# EAGLE design badge (EAGLE 5.11)

## Sheet 1 of 3
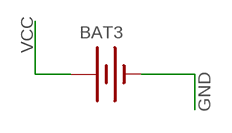
[diagram p0: schematic, sheet 1]

### Parts
BAT3  BATTERYCR123A  [BATTERY_CR123A]

### Nets
GND: BAT3.- ; also sheet 2,3
VCC: BAT3.+ ; also sheet 2,3

## Sheet 2 of 3
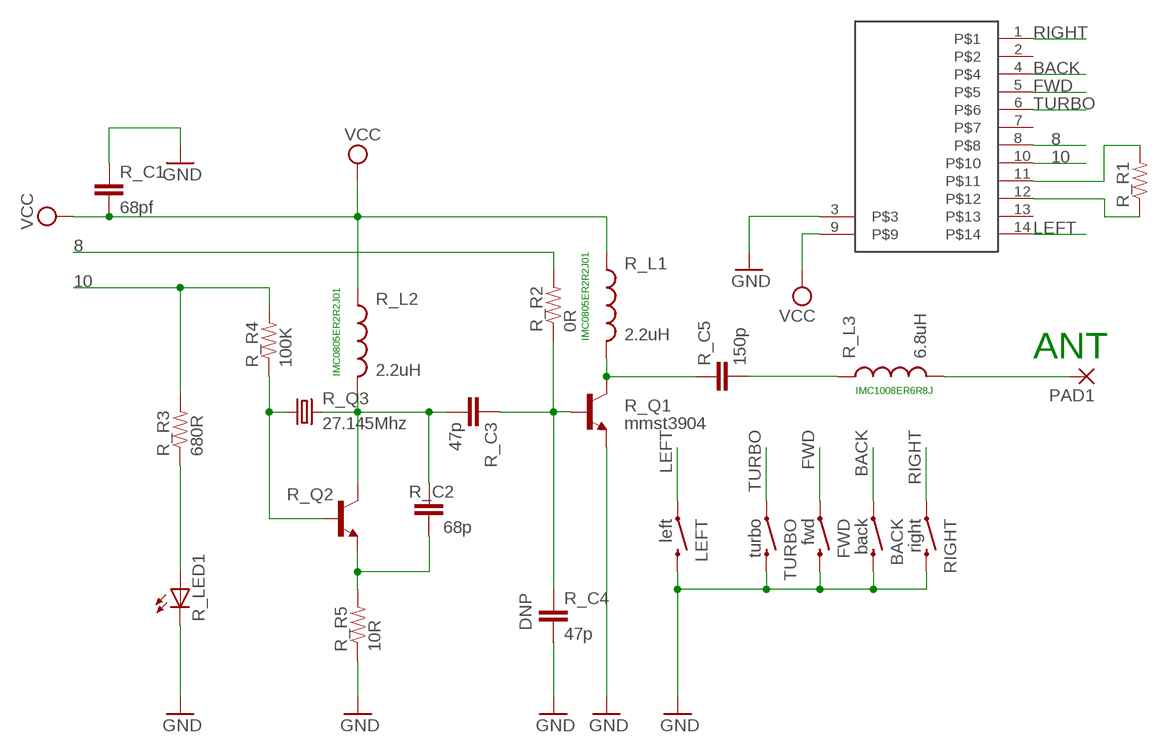
[diagram p1: schematic, sheet 2]

### Parts
BACK  back  SWITCH-MOMENTARY-2-SMD-1101NE  [TACTILE-SWITCH-1101NE]
FWD  fwd  SWITCH-MOMENTARY-2-SMD-1101NE  [TACTILE-SWITCH-1101NE]
LEFT  left  SWITCH-MOMENTARY-2-SMD-1101NE  [TACTILE-SWITCH-1101NE]
PAD1  2,54/1,0  [2,54/1,0]
R_C1  68pf  CAP0805  [0805]
R_C2  68p  CAP0805  [0805]
R_C3  47p  CAP0805  [0805]
R_C4  47p  CAP0805  [0805]
R_C5  150p  CAP0805  [0805]
R_L1  2.2uH  INDUCTOR0805  [0805]
R_L2  2.2uH  INDUCTOR0805  [0805]
R_L3  6.8uH  INDUCTOR0805  [0805]
R_LED1  LEDCHIPLED_1206  [CHIPLED_1206]
R_Q1  mmst3904  TRANSISTOR_NPNSOT23-3  [SOT23-3]
R_Q2  TRANSISTOR_NPNSOT23-3  [SOT23-3]
R_Q3  27.145Mhz  CRYSTALHC49US  [HC49US]
R_R1  RESISTORPTH-1/4W  [AXIAL-0.4]
R_R2  0R  RESISTOR  [0805]
R_R3  680R  RESISTOR  [0805]
R_R4  100K  RESISTOR  [0805]
R_R5  10R  RESISTOR  [0805]
R_U1  TX-2B  [DIP14]
RIGHT  right  SWITCH-MOMENTARY-2-SMD-1101NE  [TACTILE-SWITCH-1101NE]
TURBO  turbo  SWITCH-MOMENTARY-2-SMD-1101NE  [TACTILE-SWITCH-1101NE]

### Nets
8: R_R2.2 R_U1.8
10: R_R3.2 R_R4.2 R_U1.10
BACK: BACK.P$1 R_U1.4 ; also sheet 3
FWD: FWD.P$1 R_U1.5 ; also sheet 3
GND: BACK.P$2 FWD.P$2 LEFT.P$2 R_C1.1 R_C4.2 R_LED1.C R_Q1.2(E) R_R5.1 R_U1.3 RIGHT.P$2 TURBO.P$2 ; also sheet 1,3
LEFT: LEFT.P$1 R_U1.14 ; also sheet 3
N$4: R_C5.1 R_L1.2 R_Q1.3(C)
N$10: R_R1.P$2 R_U1.11
N$11: R_R1.P$1 R_U1.12
N$12: R_C3.1 R_C4.1 R_Q1.1(B) R_R2.1
N$13: R_C2.2 R_C3.2 R_L2.2 R_Q2.3(C) R_Q3.2
N$14: R_Q2.1(B) R_Q3.1 R_R4.1
N$15: R_C2.1 R_Q2.2(E) R_R5.2
N$16: R_LED1.A R_R3.1
N$17: R_C5.2 R_L3.1
N$18: PAD1.1(P) R_L3.2
RIGHT: R_U1.1 RIGHT.P$1 ; also sheet 3
TURBO: R_U1.6 TURBO.P$1 ; also sheet 3
VCC: R_C1.2 R_L1.1 R_L2.1 R_U1.9 ; also sheet 1,3
Unconnected: R_U1.2 R_U1.7 R_U1.13

### Notes on the sheet
- IMC0805ER2R2J01
- ANT
- IMC0805ER2R2J01
- IMC1008ER6R8J
- DNP

## Sheet 3 of 3
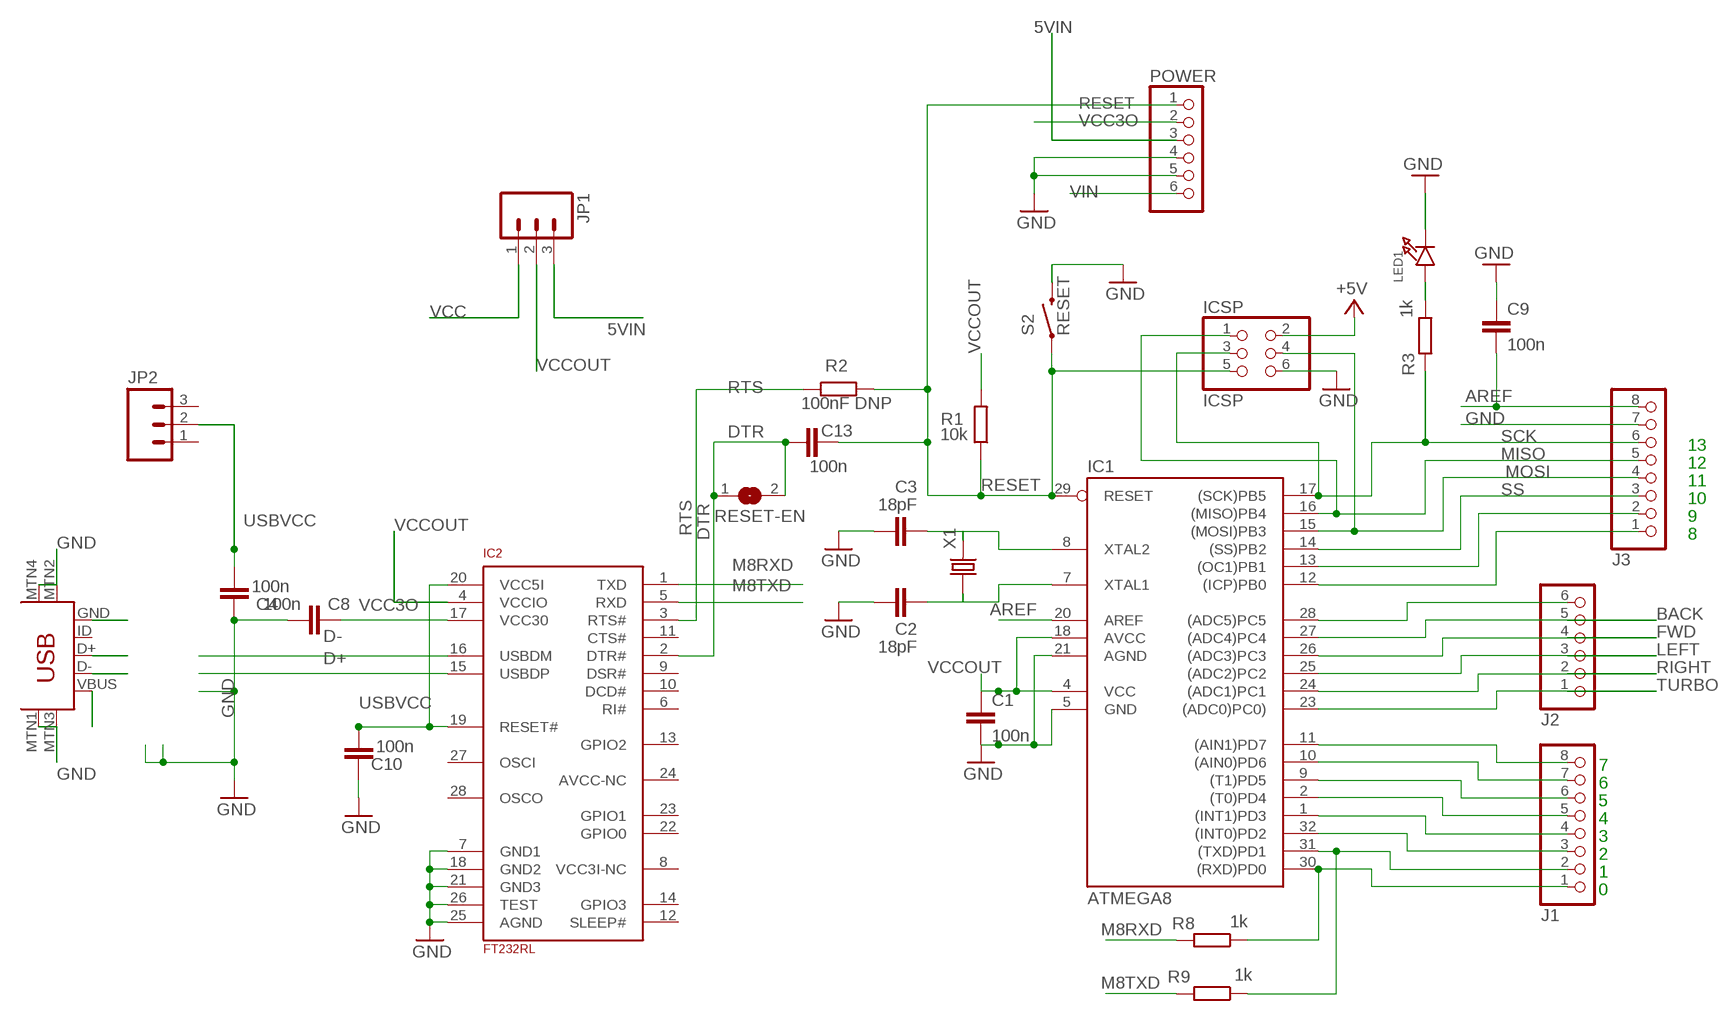
[diagram p2: schematic, sheet 3]

### Parts
C1  100n  C-EU  [C0805RND]
C2  18pF  C-EU  [C0805RND]
C3  18pF  C-EU  [C0805RND]
C4  100n  C-EU  [C0805RND]
C8  100n  C-EU  [C0805RND]
C9  100n  C-EU  [C0805RND]
C10  100n  C-EU  [C0805RND]
C13  100n  C-EU  [C0805RND]
IC1  ATMEGA8  AT90S4433A  [TQFP32-08]
IC2  FT232RL  [SSOP28]
ICSP  ICSP  PINHD-2X3  [2X03]
J1  PINHD-1X8  [1X08]
J2  PINHD-1X6  [1X06]
J3  PINHD-1X8  [1X08]
JP1  M03LOCK  [1X03_LOCK]
JP2  M03LOCK  [1X03_LOCK]
LED1  LED1206  [CHIPLED_1206]
POWER  PINHD-1X6  [1X06]
R1  10k  R-EU_  [R0805RND]
R2  100nF DNP  R-EU_  [R0805RND]
R3  1k  R-EU_  [R0805RND]
R8  1k  R-EU_  [R0805RND]
R9  1k  R-EU_  [R0805RND]
RESET-EN  SJ  [SJ]
S2  RESET  SWITCH-MOMENTARY-2-SMD-1101NE  [TACTILE-SWITCH-1101NE]
U$1  USB-MINIB-5PIN  [USB-MINIB]
X1  CRYSTAL-5032  [5032]

### Nets
5VIN: JP1.3 POWER.3
AREF [aref]: C9.2 IC1.20(AREF) J3.8
BACK: IC1.27((ADC4)PC4) J2.5 ; also sheet 2
D+: IC2.15(USBDP) U$1.D+
D-: IC2.16(USBDM) U$1.D-
DTR: C13.1 IC2.2(DTR#) RESET-EN.1 RESET-EN.2
FWD: IC1.26((ADC3)PC3) J2.4 ; also sheet 2
GND: C1.2 C2.1 C3.1 C4.2 C8.1 C9.1 C10.2 IC1.5(GND) IC1.21(AGND) IC2.7(GND1) IC2.18(GND2) IC2.21(GND3) IC2.25(AGND) IC2.26(TEST) ICSP.6 J3.7 LED1.C POWER.4 POWER.5 S2.P$2 U$1.GND U$1.MTN1(MTN2) U$1.MTN2(MTN3) U$1.MTN3(MTN1) U$1.MTN4 ; also sheet 1,2
LEFT: IC1.25((ADC2)PC2) J2.3 ; also sheet 2
M8RXD: IC2.1(TXD) R8.2
M8TXD: IC2.5(RXD) R9.2
MISO: IC1.16((MISO)PB4) ICSP.1 J3.5
MOSI: IC1.15((MOSI)PB3) ICSP.4 J3.4
N$1: IC1.32((INT0)PD2) J1.3
N$2: IC1.1((INT1)PD3) J1.4
N$3: IC1.2((T0)PD4) J1.5
N$5: IC1.9((T1)PD5) J1.6
N$6: C2.2 IC1.7(XTAL1) X1.1
N$7: C3.2 IC1.8(XTAL2) X1.2
N$8: IC1.10((AIN0)PD6) J1.7
N$9: IC1.11((AIN1)PD7) J1.8
N$19: LED1.A R3.1
N$24: IC1.28((ADC5)PC5) J2.6
N$25: IC1.12((ICP)PB0) J3.1
N$26: IC1.13((OC1)PB1) J3.2
PD0: IC1.30((RXD)PD0) J1.1 R8.1
PD1: IC1.31((TXD)PD1) J1.2 R9.1
RESET: C13.2 IC1.29(RESET) ICSP.5 POWER.1 R1.1 R2.2 S2.P$1
RIGHT: IC1.24((ADC1)PC1) J2.2 ; also sheet 2
RTS: IC2.3(RTS#) R2.1
SCK: IC1.17((SCK)PB5) ICSP.3 J3.6 R3.2
SS: IC1.14((SS)PB2) J3.3
TURBO: IC1.23((ADC0)PC0)) J2.1 ; also sheet 2
USBVCC [usbvcc]: C4.1 C10.1 IC2.19(RESET#) IC2.20(VCC5I) JP2.2 U$1.VBUS
VCC: JP1.1 ; also sheet 1,2
VCC3O: C8.2 IC2.17(VCC30) POWER.2
VCCOUT [usbvcc]: C1.1 IC1.4(VCC) IC1.18(AVCC) IC2.4(VCCIO) ICSP.2 JP1.2 R1.2 ; supply symbol labelled +5V
VIN [power]: POWER.6
Unconnected: IC2.6(RI#) IC2.8(VCC3I-NC) IC2.9(DSR#) IC2.10(DCD#) IC2.11(CTS#) IC2.12(SLEEP#) IC2.13(GPIO2) IC2.14(GPIO3) IC2.22(GPIO0) IC2.23(GPIO1) IC2.24(AVCC-NC) IC2.27(OSCI) IC2.28(OSCO) JP2.1 JP2.3 U$1.ID

### Notes on the sheet
- 13
- 12
- 11
- 10
- 9
- 8
- 7
- 6
- 5
- 4
- 3
- 2
- 1
- 0

## Library data of the parts
BACK FWD LEFT RIGHT TURBO = rf_blinky:SWITCH-MOMENTARY-2
BAT3 = tvbgone-adj:BATTERY: Battery Holders Various common sizes : AA, AAA, 20mm coin cell and 12mm coin cell.
C1-C4 C8-C10 C13 = rcl:C-EU: CAPACITOR, European symbol
IC1 = atmel:AT90S4433: MICROCONTROLLER 4 Kbytes FLASH 128 bytes SRAM 256 bytes EEPROM UART 6-channel 10 bit ADC
IC2 = SmartPrj:FT232RL
ICSP = pinhead:PINHD-2X3: PIN HEADER
J1 J3 = pinhead:PINHD-1X8: PIN HEADER
J2 POWER = pinhead:PINHD-1X6: PIN HEADER
JP1 JP2 = SparkFun:M03: Header 3 Standard 3-pin 0.1" header. Use with straight break away headers (SKU : PRT-00116), right angle break away headers (PRT-00553), swiss pins (PRT-00743), machine pins (PRT-00117), and female headers (PRT-00115). Molex polarized connector foot print use with SKU : PRT-08232 with associated crimp pins and housings.
LED1 = microbuilder:LED: LED
PAD1 = wirepad:2,54/1,0: THROUGH-HOLE PAD
R1-R3 R8 R9 = rcl:R-EU_: RESISTOR, European symbol
R_C1-R_C5 = SparkFun:CAP: Capacitor Standard 0603 ceramic capacitor, and 0.1" leaded capacitor.
R_L1-R_L3 = rf_blinky:INDUCTOR: Inductors Basic Inductor/Choke - 0603 and 1206. Footprints are not proven and vary greatly between part numbers.
R_LED1 = led:LED: LED
R_Q1 R_Q2 = SparkFun:TRANSISTOR_NPN: Transistor NPN BJT configuration in SOT23 package. MMBT2222 is the common NPN we use. Double check BCE configuration again layout.
R_Q3 = SparkFun:CRYSTAL: Crystals Various standard crystals. Proven footprints. Spark Fun Electronics SKU : COM-00534
R_R1 = rf_blinky:RESISTOR: Resistor
R_R2-R_R5 = V3_slice_noshift:RESISTOR: Resistor
R_U1 = badge:TX-2B
RESET-EN = jumper:SJ: SMD solder JUMPER
S2 = SparkFun:SWITCH-MOMENTARY-2
U$1 = SparkFun:USB-MINIB: Mini-USB "B" connector with 5th pin broken out. Created new symbol breaking out 5th "ID" pin in mini/micro USB connector spec. See: http://en.wikipedia.org/wiki/Mini_usb#Cables. Uses same footprint as 4-pin symbol. Also added pins to connect to mounting / shield pads if required (probably not generally needed as signals aren't shielded once they leave the connector).
X1 = slice:CRYSTAL*: CRYSTAL

## Net classes
0 default: width 0.254 mm, drill 0.305 mm, clearance 0.152 mm
1 power: width 0.61 mm, drill 0.508 mm, clearance 0.152 mm
2 gnd: width 0.305 mm, drill 0.508 mm, clearance 0.152 mm
3 usbvcc: width 0.508 mm, drill 0.508 mm, clearance 0.152 mm
4 aref: width 0.406 mm

## Board
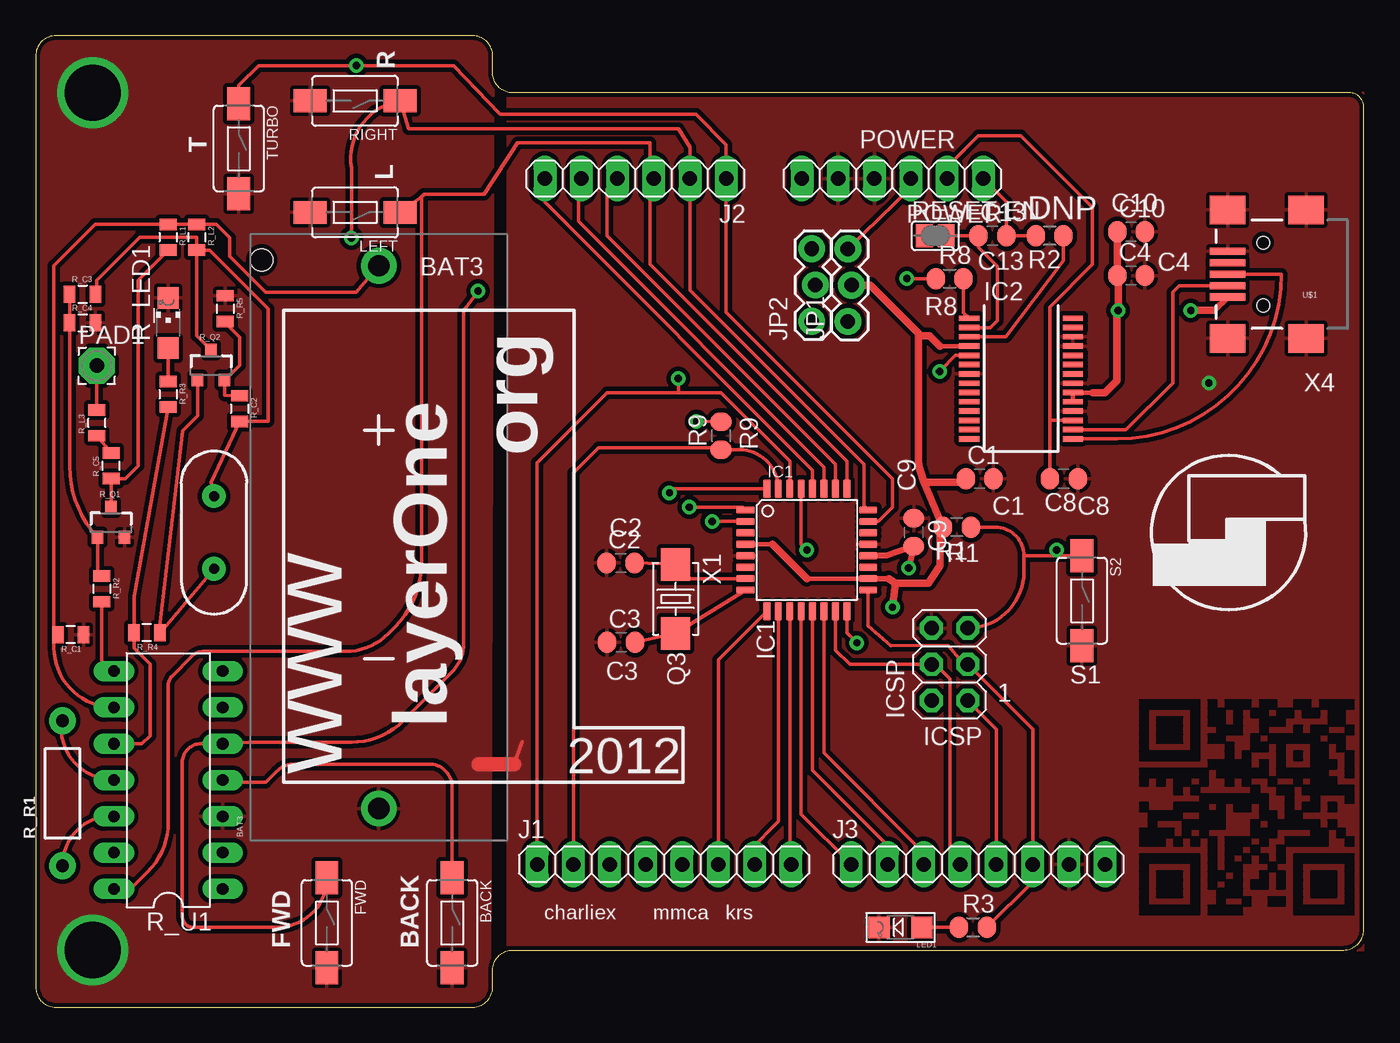
[diagram p3: board, top side]
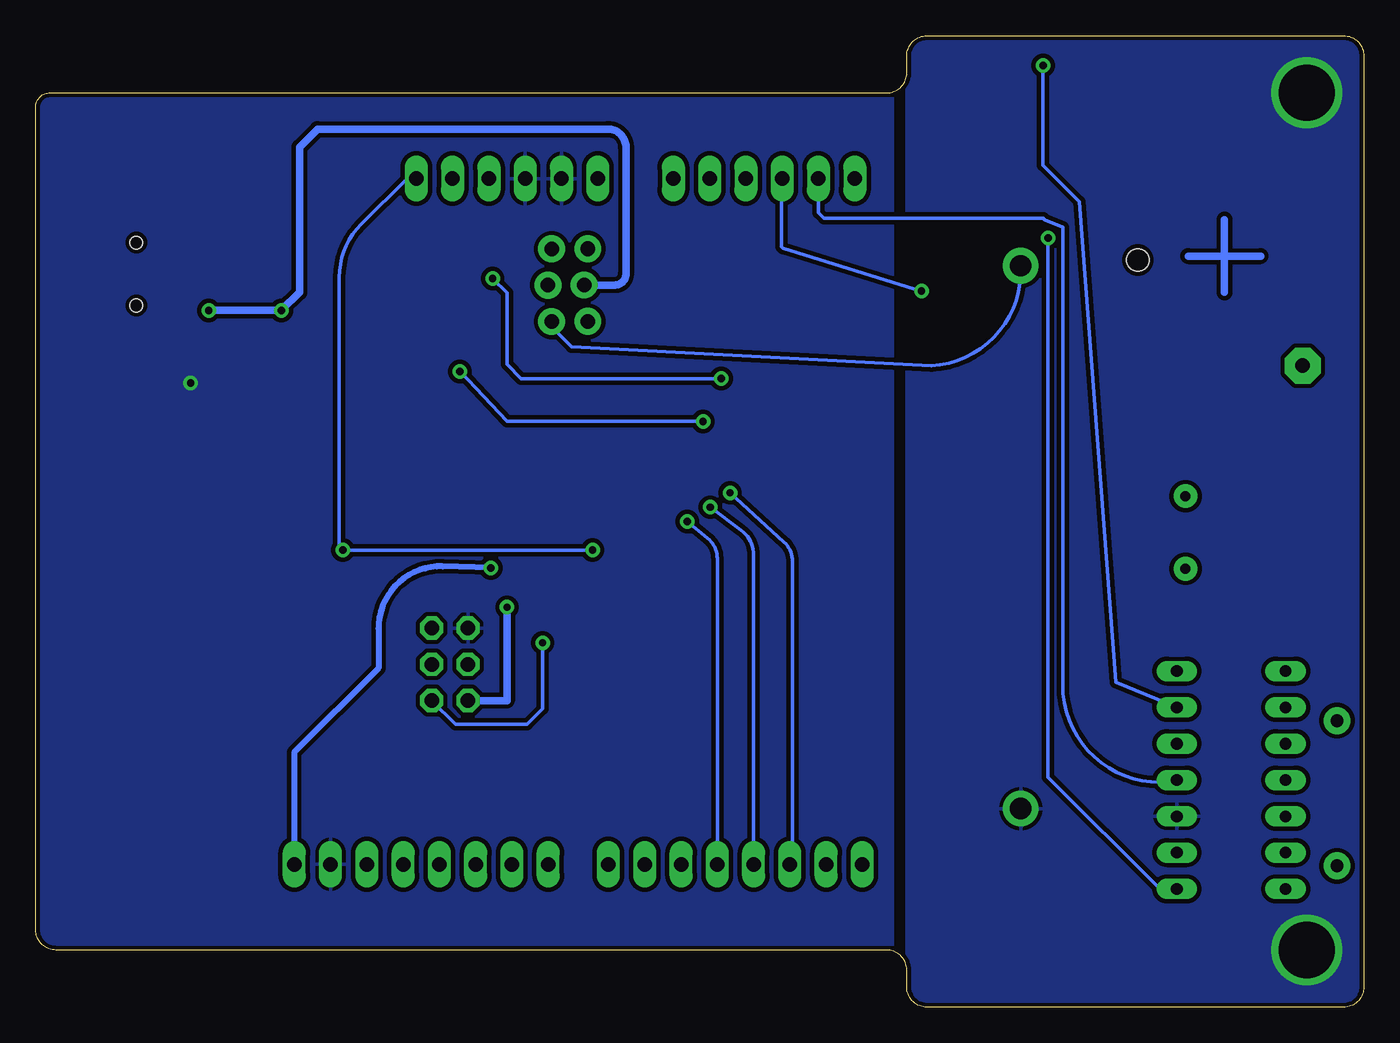
[diagram p4: board, bottom side, seen from below]

Size 93 x 68 mm. Coordinates in mm from the lower left corner, seen from the top.
Outline: 33.41,64 arc-90 32,65.41 32,66.59 arc90 30.59,68 1.41,68 arc90 0,66.59 0,1.41 arc90 1.41,0 30.59,0 arc90 32,1.41 32,2.59 arc-90 33.41,4 91.59,4 arc90 93,5.41 93,63 arc90 92,64 33.41,64
Copper layers (1*16): Top 0.0356mm / dielectric 1.5011mm / Bottom 0.0356mm
Design rules "SparkFun-mod *": minimum track width 8mil, minimum drill 20mil, track to track 12mil, track to pad 12mil, pad to pad 8mil, via to via 8mil, smd to smd 8mil, copper to edge 12mil, drill to drill 8mil, minimum pad ring 12mil, minimum via ring 10mil, stop-mask expansion 4mil, vias tented up to drill 25mil, thermal gap 10mil
tRestrict: area 77.3,6.5 to 77.9,7.1; area 77.3,7.1 to 77.9,7.7; area 77.3,7.7 to 77.9,8.3; area 77.3,8.3 to 77.9,8.9; area 77.3,8.9 to 77.9,9.5; area 77.3,9.5 to 77.9,10.1; area 77.3,10.1 to 77.9,10.7; area 77.3,11.3 to 77.9,11.9; area 77.3,11.9 to 77.9,12.5; area 77.3,13.7 to 77.9,14.3; area 77.3,15.5 to 77.9,16.1; area 77.3,16.1 to 77.9,16.7; 319 more areas
Milling: 16 lines

### Footprints (pad centres in the part's own frame; a part is rotated, then mirrored left to right if it is on the bottom)
TACTILE-SWITCH-1101NE = smd 2.3 x 1.6: P$1 -3.15,0; P$2 3.15,0
BATTERY_CR123A = drill 1.5 pad 2.5 round: + 19,0; - -19,0 | hole 1.575: 19.4,8.2
C0805RND = smd 1.3 x 1.5: 1 -0.977,0; 2 0.977,0
TQFP32-08 = smd 1.27 x 0.508: 1 -4.293,2.8; 2 -4.293,2; 3 -4.293,1.2; 4 -4.293,0.4; 5 -4.293,-0.4; 6 -4.293,-1.2; 7 -4.293,-2; 8 -4.293,-2.8; 17 4.293,-2.8; 18 4.293,-2; 19 4.293,-1.2; 20 4.293,-0.4; 21 4.293,0.4; 22 4.293,1.2; 23 4.293,2; 24 4.293,2.8 | smd 0.508 x 1.27: 9 -2.8,-4.293; 10 -2,-4.293; 11 -1.2,-4.293; 12 -0.4,-4.293; 13 0.4,-4.293; 14 1.2,-4.293; 15 2,-4.293; 16 2.8,-4.293; 25 2.8,4.293; 26 2,4.293; 27 1.2,4.293; 28 0.4,4.293; 29 -0.4,4.293; 30 -1.2,4.293; 31 -2,4.293; 32 -2.8,4.293
SSOP28 = smd 0.381 x 1.499: 1 -4.225,-3.625; 2 -3.575,-3.625; 3 -2.925,-3.625; 4 -2.275,-3.625; 5 -1.625,-3.625; 6 -0.975,-3.625; 7 -0.325,-3.625; 8 0.325,-3.625; 9 0.975,-3.625; 10 1.625,-3.625; 11 2.275,-3.625; 12 2.925,-3.625; 13 3.575,-3.625; 14 4.225,-3.625; 15 4.225,3.625; 16 3.575,3.625; 17 2.925,3.625; 18 2.275,3.625; 19 1.625,3.625; 20 0.975,3.625; 21 0.325,3.625; 22 -0.325,3.625; 23 -0.975,3.625; 24 -1.625,3.625; 25 -2.275,3.625; 26 -2.925,3.625; 27 -3.575,3.625; 28 -4.225,3.625
2X03 = drill 1.016 octagon: 1 -2.54,-1.27; 2 -2.54,1.27; 3 0,-1.27; 4 0,1.27; 5 2.54,-1.27; 6 2.54,1.27
1X08 = drill 1.016 long: 1 -8.89,0; 2 -6.35,0; 3 -3.81,0; 4 -1.27,0; 5 1.27,0; 6 3.81,0; 7 6.35,0; 8 8.89,0
1X06 = drill 1.016 long: 1 -6.35,0; 2 -3.81,0; 3 -1.27,0; 4 1.27,0; 5 3.81,0; 6 6.35,0
1X03_LOCK = drill 1.016 pad 1.88 round: 1 0,0.127; 2 2.54,-0.127; 3 5.08,0.127
CHIPLED_1206 = smd 1.5 x 1.5: A 0,-1.496; C 0,1.496
2,54/1,0 = drill 1.016 pad 2.54 octagon: 1 0,0
R0805RND = smd 1.3 x 1.5: 1 -0.977,0; 2 0.977,0
0805 = smd 0.8 x 1.2: 1 -0.9,0; 2 0.9,0
CHIPLED_1206' = smd 1.5 x 1.5: A 0,-1.75; C 0,1.75
SOT23-3 = smd 0.8 x 0.9: 1 -0.95,-1; 2 0.95,-1; 3 0,1.1
HC49US = drill 0.7 pad 1.651 round: 1 -2.54,0; 2 2.54,0
AXIAL-0.4 = drill 0.9 pad 1.88 round: P$1 -5.08,0; P$2 5.08,0
DIP14 = drill 0.813 long: 1 -7.62,-3.81; 2 -5.08,-3.81; 3 -2.54,-3.81; 4 0,-3.81; 5 2.54,-3.81; 6 5.08,-3.81; 7 7.62,-3.81; 8 7.62,3.81; 9 5.08,3.81; 10 2.54,3.81; 11 0,3.81; 12 -2.54,3.81; 13 -5.08,3.81; 14 -7.62,3.81
SJ = smd 1.168 x 1.6: 1 -0.762,0; 2 0.762,0
USB-MINIB = smd 2.5 x 0.5: D+ 2.5,0; D- 2.5,0.8; GND 2.5,-1.6; ID 2.5,-0.8; VBUS 2.5,1.6 | smd 2.5 x 2: MTN1 -3,4.5; MTN2 2.5,4.5; MTN3 -3,-4.5; MTN4 2.5,-4.5 | hole 0.9: 0,2.2; 0,-2.2
5032 = smd 2.286 x 2.032: 1 -2.413,0; 2 2.413,0

### Placement (x,y rotation side)
BACK  29.17,5.9 270 top
BAT3  24.03,32.9 90 top
C1  66.1,37 0 top
C2  40.96,31.09 0 top
C3  40.99,25.54 0 top
C4  76.71,51.21 0 top
C8  72,37 180 top
C9  61.48,33.25 270 top
C10  76.71,54.27 0 top
C13  67,54 0 top
FWD  20.39,5.9 270 top
IC1  54,32 0 top
IC2  69,44 270 top
ICSP  64,24 90 top
J1  44,10 0 top
J2  42,58 180 top
J3  66,10 0 top
JP1  57,48 90 top
JP2  54.46,48.01 90 top
LED1  60.56,5.59 90 top
LEFT  22.36,55.63 180 top
PAD1  4.28,44.9 0 top
POWER  60,58 180 top
R1  64.5,33.6 180 top
R2  71,54 180 top
R3  65.64,5.59 0 top
R8  64,51 0 top
R9  48,40 90 top
R_C1  [0805]  2.45,26.08 180 top
R_C2  47p  [0805]  14.28,41.9 270 top
R_C3  3.28,49.9 0 top
R_C4  3.28,47.9 0 top
R_C5  5.28,37.9 90 top
R_L1  9.28,53.9 270 top
R_L2  11.28,53.9 270 top
R_L3  4.28,40.9 90 top
R_LED1  [CHIPLED_1206']  9.28,47.9 0 top
R_Q1  [SOT23-3]  5.28,33.9 0 top
R_Q2  12.28,44.9 0 top
R_Q3  12.48,33.23 90 top
R_R1  1.87,14.97 90 top
R_R2  10K  [0805]  4.63,29.28 270 top
R_R3  9.28,42.9 270 top
R_R4  7.79,26.21 180 top
R_R5  13.28,48.9 270 top
R_U1  9.28,15.9 90 top
RESET-EN  63,54 0 top
RIGHT  22.36,63.44 180 top
S2  73.26,28.45 270 top
TURBO  14.22,60.1 270 top
U$1  85.96,51.31 180 top
X1  44.81,28.58 270 top

### Tracks (layer width: path | path; a pad name or v marks a point on that pad's centre or on a via)
5VIN
  Top 0.254: JP1.3 61.27,57.35 POWER.3
8
  Top 0.254: R_U1.8 arc-90 4.63,24.36 R_R2.2
10
  Top 0.254: R_U1.10 7.44,18.44 8,19 8,24 6.89,25.11 R_R4.2 6.91,28.77 R_R3.2
AREF  (via drill 0.51)
  Top 0.406: IC1.20 59.58,31.6 C9.2 v61.13,30.75
  Bottom 0.406: v61.13,30.75 64.5,30.85 arc-92 69,26.5 69,23.73 74.89,17.84 J3.8
BACK
  Top 0.254: IC1.27 55.2,37.8 38,55 38,57.81 J2.5 | 14.28,15.9 R_U1.4 13.24,15.75 16.11,15.75 16.85,16.49 arc-45 18.12,17.02 27.54,17.02 arc-90 29.17,15.39 BACK.P$1
  Bottom 0.254: 38.13,57.94 J2.5 38.19,55.61 37.79,55.21 22.46,55.21 arc90 22.36,55.11 21.09,54.6 21.09,22.55 arc-90 14.28,15.74 13.25,15.74 arc-90 R_U1.4
D+
  Top 0.254: U$1.D+ 87.23,51.31 arc-90 75.69,39.77 IC2.15
D-
  Top 0.254: U$1.D- 80.08,50.51 79.61,50.04 79.61,43.69 76.34,40.42 IC2.16
DTR
  Top 0.254: RESET-EN.1 RESET-EN.2 C13.1 66.02,53.18 67.34,51.86 67.34,48.05 66.86,47.58 IC2.2
FWD  (via drill 0.51)
  Top 0.254: IC1.26 56,38 40,54 40,57.27 J2.4 | v30.97,50.13 29.98,48.76 29.98,25.5 arc-45 29.12,23.43 25.74,20.05 arc-45 22.11,18.54 14.92,18.54 13.54,18.44 R_U1.5 11.56,18.44 arc90 10.27,17.15 10.27,6.35 arc90 11.03,5.59 16.93,5.59 arc90 FWD.P$1
  Bottom 0.254: 40.73,57 J2.4 40.77,57.96 40.77,53.23 40.67,53.13 v30.97,50.13
GND  (via drill 0.51, 3.94)
  Top 0.254: 34.05,18.57 33.48,17
  Top 1: 33.48,17 31,17
  other vias: 4,64 4,4 82.15,43.69
  pour Top (isolate 0.254): 29.23,-0.84 arc90 31.77,1.7 32.04,68.53 -0.52,68.54 -0.52,1.7 arc90 2.02,-0.84
  pour Top (isolate 0.076): 33,64 33,4 93,4 93,64
  pour Bottom (isolate 0.254): 32,68 32,-1 -1,-1 -1,68
  pour Bottom (isolate 0.254): 33,64 33,4 93,4 93,64
LEFT
  Top 0.254: IC1.25 56.8,38.2 43,52 43,57.73 J2.3 43,58.27 43,60.5 33.73,60.5 31.4,56.9 27.28,56.9 | R_U1.14 6.66,8.28 7.85,9.47 arc45 9.28,12.92 9.28,22.51 arc-45 9.55,23.17 10.97,24.59 arc-45 11.72,24.9 21.7,24.9 arc45 24.67,26.13 25.15,26.61 arc45 27.01,31.09 27.01,56.63 arc-90 27.28,56.9 | 27.28,56.9 LEFT.P$1
M8RXD
  Top 0.254: IC2.1 64.98,48.62 R8.2
M8TXD  (via drill 0.51)
  Top 0.254: IC2.5 64.4,45.62 v63.3,44.5 | v46.27,41 47.56,40.98 R9.2
  Bottom 0.254: v63.3,44.5 60,41 v46.27,41
MISO  (via drill 0.51)
  Top 0.254: ICSP.1 67.27,19.46 J3.5 67.27,9.4 | IC1.16 56.8,26.2 v57.5,25.5
  Bottom 0.254: v57.5,25.5 57.5,20.9 58.6,19.8 63.61,19.8 ICSP.1
MOSI
  Top 0.254: IC1.15 56,25 57,24 ICSP.4 63,24 64,23 64,10.73 J3.4
N$1  (via drill 0.51)
  Top 0.254: IC1.32 44.67,36.29 v44.38,36
  Bottom 0.254: J1.3 arc-90 40,10.19 40,31.2 arc-48 40.59,32.54 v44.38,36
N$2  (via drill 0.51)
  Top 0.254: v45.76,35 49.51,35 IC1.1
  Bottom 0.254: v45.76,35 43.6,33.38 arc53 42.73,31.64 J1.4
N$3  (via drill 0.51)
  Top 0.254: IC1.2 v47.38,34
  Bottom 0.254: v47.38,34 45.94,32.82 arc51 45.27,31.4 J1.5
N$4
  Top 0.254: R_L1.2 7.18,50.9 7.18,37.9 6.28,37 R_C5.1 R_Q1.3
N$5
  Top 0.254: J1.6 47.81,24.32 IC1.9
N$6
  Top 0.254: IC1.7 45.77,30 45.32,30.99 X1.1 C2.2
N$7
  Top 0.254: IC1.8 X1.2 C3.2
N$8
  Top 0.254: IC1.10 52,13 50,11 50,10.35 J1.7
N$9
  Top 0.254: IC1.11 52.8,10.09 J1.8
N$10
  Top 0.254: R_U1.11 arc-90 1.77,19.6 R_R1.P$2
N$11
  Top 0.254: R_R1.P$1 arc-90 5.24,13.36 R_U1.12
N$12
  Top 0.254: R_C3.1 R_C4.1 2.38,37.85 arc43 R_Q1.1 4.33,30.48 R_R2.1
N$13
  Top 0.254: R_Q3.2 12.28,36.73 R_C2.2 16.28,41 16.28,48.9 12.18,53 R_L2.2 | R_Q2.3 11.28,47 R_L2.2 | R_L2.2 11.28,53.9 7.28,53.9 4.28,50.9 4.28,50 R_C3.2
N$14
  Top 0.254: 8.63,26.06 R_Q3.1 | 8.63,26.06 10.28,40.33 11.33,41.38 R_Q2.1 | R_R4.1 8.69,26.12 arc-90 8.63,26.06
N$15
  Top 0.254: R_C2.1 13.23,42.85 R_Q2.2 14.28,44.95 14.28,46.9 13.28,47.9 R_R5.2
N$16
  Top 0.254: R_LED1.A R_R3.1
N$17
  Top 0.254: R_C5.2 R_L3.1
N$18
  Top 0.254: PAD1.1 R_L3.2
N$19
  Top 0.254: R3.1 LED1.A
N$20
  Bottom 0.508: 12.3,52.58 7.22,52.58
N$21
  Bottom 0.508: 9.76,55.12 9.76,50.04
N$24
  Top 0.254: IC1.28 54.4,37.6 35.65,56.35 J2.6
N$25
  Top 0.254: IC1.12 53.6,13.51 J3.1
N$26
  Top 0.254: IC1.13 54.4,16.6 59.65,11.35 J3.2
PD0  (via drill 0.51)
  Top 0.254: J1.1 35.11,38.11 40,43 45,43 | 45,43 48,43 52.8,38.2 IC1.30 | R8.1 v61,51 | v45,44 45,43
  Bottom 0.254: v61,51 60,50 60,45 59,44 v45,44
PD1
  Top 0.254: IC1.31 arc90 49.27,39.02 R9.1 | R9.1 47.98,39 | J1.2 37.65,37.41 39.4,39.16 47.86,39.16 R9.1
RESET  (via drill 0.51)
  Top 0.254: POWER.1 67.98,56.37 C13.2 R2.2 | IC1.29 53.6,32.4 v54,32 | 69.2,31.6 69.2,30.47 arc-90 ICSP.5 | 69.2,31.6 S2.P$1 71.49,31.6 v71.49,32 | 69.2,31.6 arc90 67.2,33.6 R1.1
  Bottom 0.254: POWER.1 67,58 70.21,54.79 arc-45 71.74,51.1 71.74,32 v71.49,32 v54,32
RIGHT  (via drill 0.51)
  Top 0.254: IC1.24 58,35.09 58,38 45.81,50.19 J2.2 45.81,60.19 45,61.5 26.11,61.5 RIGHT.P$1 arc90 22.11,58.76 v22.11,53.84
  Bottom 0.254: v22.11,53.84 22.11,16.1 14.28,8.28 R_U1.1
RTS
  Top 0.254: IC2.3 67.92,46.92 71.98,52.25 R2.1
SCK
  Top 0.2: 63.9,25.3 59.9,25.3
  Top 0.254: 63.9,25.3 65,24 ICSP.3 69.81,19.46 J3.6 69.81,8.78 R3.2 | 59.9,25.3 58.29,26.71 IC1.17
SS
  Top 0.254: IC1.14 55.2,17.8 62,11 62,10.19 J3.3
TURBO  (via drill 0.51)
  Top 0.254: IC1.23 59,34 60,35 60,37 48.35,48.65 J2.1 48.35,60.38 46.23,62.5 32.5,62.5 29.28,65.9 22.46,65.9 v22.46,65.91 15.6,65.91 14.22,64.53 TURBO.P$1
  Bottom 0.254: R_U1.6 17.38,22.73 19.92,56.39 22.46,58.93 v22.46,65.91
USBVCC  (via drill 0.51)
  Top 0.3: 74.03,43.02 IC2.20 IC2.19
  Top 0.457: U$1.VBUS 82.52,48.77
  Top 0.508: 74.03,43.02 74.88,43.02 75.7,43.84 75.7,48.67 v75.8,48.77 75.8,51.14 C4.1 C10.1 | 82.52,48.77 v80.88,48.77
  Bottom 0.508: v80.88,48.77 v75.8,48.77 74.53,50.04 74.53,60.2 73.26,61.47 52.94,61.47 arc90 51.67,60.2 51.67,51.31 arc90 52.43,50.55 JP2.2
VCC
  Top 0.254: R_U1.9 arc-90 1.28,25.17 1.28,25.76 R_C1.2 arc90 1.28,26.14 1.28,51.9 4.18,54.8 R_L1.1 9.28,54.9 9.38,54.8 R_L2.1 12.62,54.8 13.57,53.85 13.57,52.58 16.11,50.04 22.42,50.04 BAT3.+
  Bottom 0.254: JP1.1 56.87,47.62 55.48,46.23 30.28,44.9 arc-90 BAT3.+
VCC3O
  Top 0.254: 71.02,40.98 arc90 71,41 71,49 74,52 74,56 69,61 66,61 63.81,58.81 POWER.2 | 71.02,40.98 C8.2 | 71.02,40.98 71.12,41.08 IC2.17
VCCOUT  (via drill 0.51)
  Top 0.3: IC2.4 63.32,46.27 | IC1.18 54,30 | 51.6,32.4 IC1.4
  Top 0.4: 59.75,30 IC1.18
  Top 0.508: 61.82,37.98 62.19,36.76 | 62.19,36.76 R1.2 63.3,33.48 63.3,30.9 62.5,29.67 60.2,29.67 | JP1.2 58.46,50.54 61.82,47.18 61.82,47 | 60.2,29.67 v60,28 | 54,30 51.6,32.4 | 61.82,47 61.82,37.98 | 61.82,37.98 61.85,38 | 63.32,46.27 62.6,47 61.82,47 | C1.1 64.88,36.76 62.19,36.76 | 60.2,29.67 59.75,30
  Bottom 0.508: ICSP.2 60,21.46 v60,28

### Text on the board
tPlace: R | POWER | T | L | C10 | DNP | BAT3 | C4 | C13 | R8 | X4 | R9 | org | C9 | C1 | C8 | C2 | R1 | IC1 | C3 | Q3 | S1 | 1 | layerOne | 2012 | ICSP | www | charliex | mmca | krs | FWD | BACK